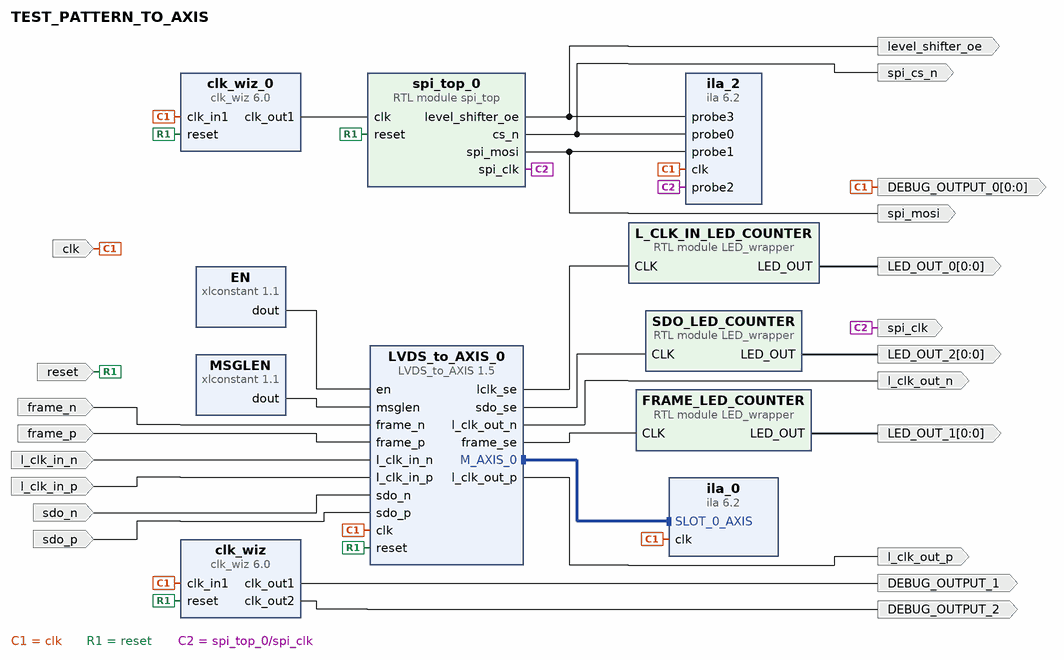
[diagram p0: block diagram of the top level]
# Vivado block design TEST_PATTERN_TO_AXIS, xc7z020clg484-1, Vivado 2024.2
create_bd_design TEST_PATTERN_TO_AXIS

create_bd_port -dir I -type rst reset
set_property -dict {CONFIG.POLARITY ACTIVE_HIGH} [get_bd_ports reset]
create_bd_port -dir O l_clk_out_p
create_bd_port -dir O l_clk_out_n
create_bd_port -dir O spi_cs_n
create_bd_port -dir O spi_mosi
create_bd_port -dir O -type clk spi_clk
create_bd_port -dir O level_shifter_oe
create_bd_port -dir I sdo_p
create_bd_port -dir I sdo_n
create_bd_port -dir I l_clk_in_p
create_bd_port -dir I l_clk_in_n
create_bd_port -dir I frame_p
create_bd_port -dir I frame_n
create_bd_port -dir O -from 0 -to 0 LED_OUT_0
create_bd_port -dir O -from 0 -to 0 LED_OUT_1
create_bd_port -dir O -from 0 -to 0 LED_OUT_2
create_bd_port -dir O -from 0 -to 0 -type clk DEBUG_OUTPUT_0
create_bd_port -dir O -type clk DEBUG_OUTPUT_1
create_bd_port -dir O -type clk DEBUG_OUTPUT_2
create_bd_port -dir I -type clk clk
set_property -dict {CONFIG.FREQ_HZ 100000000} [get_bd_ports clk]

create_bd_cell -type module -reference spi_top spi_top_0
create_bd_cell -type ip -vlnv xilinx.com:ip:xlconstant:1.1 MSGLEN
set_property -dict {CONFIG.CONST_VAL 44 CONFIG.CONST_WIDTH 6} [get_bd_cells MSGLEN]
create_bd_cell -type ip -vlnv xilinx.com:ip:xlconstant:1.1 EN
create_bd_cell -type module -reference LED_wrapper L_CLK_IN_LED_COUNTER
create_bd_cell -type module -reference LED_wrapper FRAME_LED_COUNTER
create_bd_cell -type module -reference LED_wrapper SDO_LED_COUNTER
create_bd_cell -type ip -vlnv xilinx.com:ip:ila:6.2 ila_0
set_property -dict [list \
  CONFIG.C_SLOT_0_AXIS_TDATA_WIDTH 64 \
  CONFIG.C_SLOT_0_AXIS_TID_WIDTH 0 \
  CONFIG.C_SLOT_0_AXIS_TUSER_WIDTH 0 \
  CONFIG.C_SLOT_0_AXI_PROTOCOL AXI4S \
] [get_bd_cells ila_0]
create_bd_cell -type ip -vlnv xilinx.com:ip:ila:6.2 ila_2
set_property -dict {CONFIG.C_MONITOR_TYPE Native CONFIG.C_NUM_OF_PROBES 4} [get_bd_cells ila_2]
create_bd_cell -type ip -vlnv xilinx.com:ip:clk_wiz:6.0 clk_wiz
set_property -dict [list \
  CONFIG.CLKOUT1_DRIVES BUFG \
  CONFIG.CLKOUT1_JITTER 114.829 \
  CONFIG.CLKOUT1_REQUESTED_OUT_FREQ 200 \
  CONFIG.CLKOUT2_DRIVES BUFG \
  CONFIG.CLKOUT2_JITTER 151.636 \
  CONFIG.CLKOUT2_PHASE_ERROR 98.575 \
  CONFIG.CLKOUT2_REQUESTED_OUT_FREQ 50 \
  CONFIG.CLKOUT2_USED true \
  CONFIG.CLKOUT3_DRIVES BUFG \
  CONFIG.CLKOUT4_DRIVES BUFG \
  CONFIG.CLKOUT5_DRIVES BUFG \
  CONFIG.CLKOUT6_DRIVES BUFG \
  CONFIG.CLKOUT7_DRIVES BUFG \
  CONFIG.CLK_IN1_BOARD_INTERFACE Custom \
  CONFIG.CLK_IN2_BOARD_INTERFACE Custom \
  CONFIG.FEEDBACK_SOURCE FDBK_AUTO \
  CONFIG.MMCM_BANDWIDTH OPTIMIZED \
  CONFIG.MMCM_CLKFBOUT_MULT_F 10.000 \
  CONFIG.MMCM_CLKOUT0_DIVIDE_F 5.000 \
  CONFIG.MMCM_CLKOUT1_DIVIDE 20 \
  CONFIG.MMCM_COMPENSATION ZHOLD \
  CONFIG.NUM_OUT_CLKS 2 \
  CONFIG.PRIMITIVE MMCM \
  CONFIG.RESET_BOARD_INTERFACE Custom \
  CONFIG.RESET_PORT reset \
  CONFIG.RESET_TYPE ACTIVE_HIGH \
  CONFIG.USE_INCLK_STOPPED false \
  CONFIG.USE_LOCKED false \
] [get_bd_cells clk_wiz]
create_bd_cell -type ip -vlnv xilinx.com:user:LVDS_to_AXIS:1.5 LVDS_to_AXIS_0
create_bd_cell -type ip -vlnv xilinx.com:ip:clk_wiz:6.0 clk_wiz_0
set_property -dict [list \
  CONFIG.CLKOUT1_JITTER 181.828 \
  CONFIG.CLKOUT1_PHASE_ERROR 104.359 \
  CONFIG.CLKOUT1_REQUESTED_OUT_FREQ 25 \
  CONFIG.MMCM_CLKFBOUT_MULT_F 9.125 \
  CONFIG.MMCM_CLKOUT0_DIVIDE_F 36.500 \
  CONFIG.USE_LOCKED false \
] [get_bd_cells clk_wiz_0]

# ---- connections ----

connect_bd_intf_net [get_bd_intf_pins LVDS_to_AXIS_0/M_AXIS_0] [get_bd_intf_pins ila_0/SLOT_0_AXIS]
connect_bd_net [get_bd_pins EN/dout] [get_bd_pins LVDS_to_AXIS_0/en]
connect_bd_net -net LED_wrapper_0_LED_OUT [get_bd_pins L_CLK_IN_LED_COUNTER/LED_OUT] [get_bd_ports LED_OUT_0]
connect_bd_net -net LED_wrapper_1_LED_OUT [get_bd_pins FRAME_LED_COUNTER/LED_OUT] [get_bd_ports LED_OUT_1]
connect_bd_net -net LED_wrapper_2_LED_OUT [get_bd_pins SDO_LED_COUNTER/LED_OUT] [get_bd_ports LED_OUT_2]
connect_bd_net [get_bd_pins LVDS_to_AXIS_0/frame_se] [get_bd_pins FRAME_LED_COUNTER/CLK]
connect_bd_net [get_bd_pins LVDS_to_AXIS_0/l_clk_out_n] [get_bd_ports l_clk_out_n]
connect_bd_net [get_bd_pins LVDS_to_AXIS_0/l_clk_out_p] [get_bd_ports l_clk_out_p]
connect_bd_net [get_bd_pins LVDS_to_AXIS_0/lclk_se] [get_bd_pins L_CLK_IN_LED_COUNTER/CLK]
connect_bd_net [get_bd_pins LVDS_to_AXIS_0/sdo_se] [get_bd_pins SDO_LED_COUNTER/CLK]
connect_bd_net [get_bd_pins MSGLEN/dout] [get_bd_pins LVDS_to_AXIS_0/msglen]
connect_bd_net [get_bd_ports clk] \
  [get_bd_pins ila_0/clk] [get_bd_pins ila_2/clk] [get_bd_pins clk_wiz/clk_in1] [get_bd_ports DEBUG_OUTPUT_0] \
  [get_bd_pins clk_wiz_0/clk_in1] [get_bd_pins LVDS_to_AXIS_0/clk]
connect_bd_net [get_bd_pins clk_wiz_0/clk_out1] [get_bd_pins spi_top_0/clk]
connect_bd_net [get_bd_pins clk_wiz/clk_out1] [get_bd_ports DEBUG_OUTPUT_1]
connect_bd_net [get_bd_pins clk_wiz/clk_out2] [get_bd_ports DEBUG_OUTPUT_2]
connect_bd_net [get_bd_ports frame_n] [get_bd_pins LVDS_to_AXIS_0/frame_n]
connect_bd_net [get_bd_ports frame_p] [get_bd_pins LVDS_to_AXIS_0/frame_p]
connect_bd_net [get_bd_ports l_clk_in_n] [get_bd_pins LVDS_to_AXIS_0/l_clk_in_n]
connect_bd_net [get_bd_ports l_clk_in_p] [get_bd_pins LVDS_to_AXIS_0/l_clk_in_p]
connect_bd_net [get_bd_ports reset] \
  [get_bd_pins spi_top_0/reset] [get_bd_pins clk_wiz/reset] [get_bd_pins clk_wiz_0/reset] [get_bd_pins LVDS_to_AXIS_0/reset]
connect_bd_net [get_bd_ports sdo_n] [get_bd_pins LVDS_to_AXIS_0/sdo_n]
connect_bd_net [get_bd_ports sdo_p] [get_bd_pins LVDS_to_AXIS_0/sdo_p]
connect_bd_net [get_bd_pins spi_top_0/cs_n] [get_bd_ports spi_cs_n] [get_bd_pins ila_2/probe0]
connect_bd_net [get_bd_pins spi_top_0/level_shifter_oe] [get_bd_ports level_shifter_oe] [get_bd_pins ila_2/probe3]
connect_bd_net [get_bd_pins spi_top_0/spi_clk] [get_bd_ports spi_clk] [get_bd_pins ila_2/probe2]
connect_bd_net [get_bd_pins spi_top_0/spi_mosi] [get_bd_ports spi_mosi] [get_bd_pins ila_2/probe1]

validate_bd_design
save_bd_design
